# Altium schematic sheet Microcontroller and UI.SchDoc
size A4; SheetNumber: 2
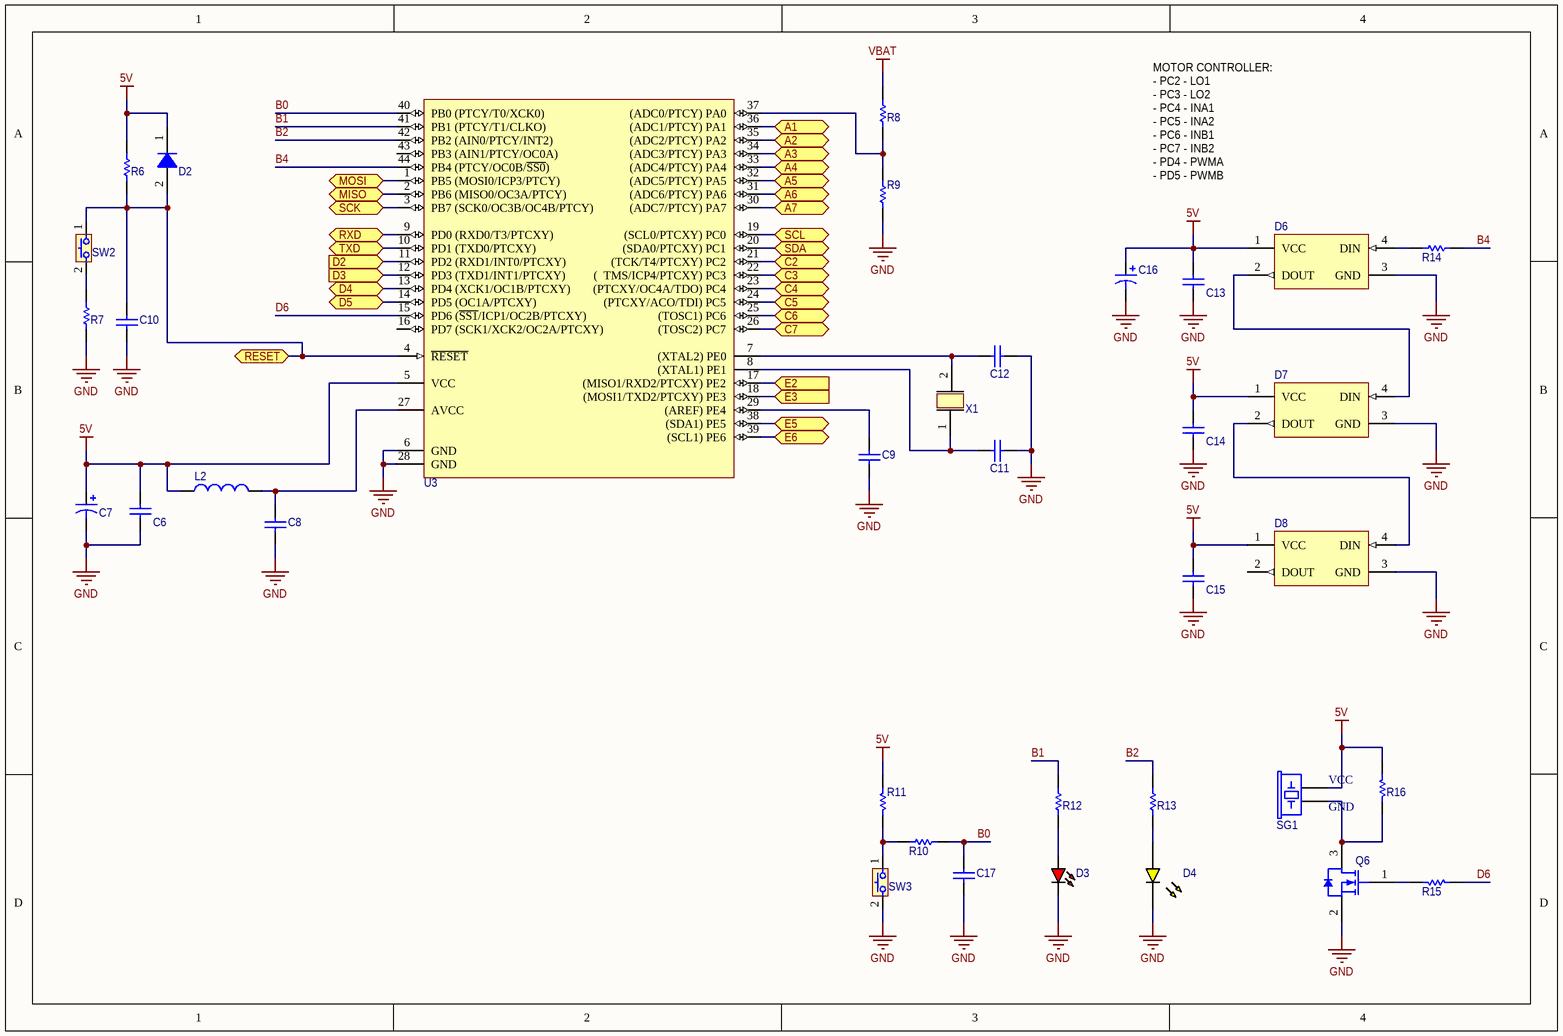
[diagram p0: Microcontroller and UI.SchDoc]

## Parts
C6  Kemet C1206C104K5RACAUTO  [CAPC3216X88X50ML20T25]  (value not drawn)
C7  Cap Pol2  [PCB-2utroa4rb2vd9is4ckmk-1]  (value not drawn)
C8  Kemet C1206C104K5RACAUTO  [CAPC3216X88X50ML20T25]  (value not drawn)
C9  Kemet C1206C104K5RACAUTO  [CAPC3216X88X50ML20T25]  (value not drawn)
C10  Kemet C1206C104K5RACAUTO  [CAPC3216X88X50ML20T25]  (value not drawn)
C11  Kemet C1206C220K5GACTU  [CAPC3216X88X50LL20T25]  (value not drawn)
C12  Kemet C1206C220K5GACTU  [CAPC3216X88X50LL20T25]  (value not drawn)
C13  Kemet C1206C104K5RACAUTO  [CAPC3216X88X50ML20T25]  (value not drawn)
C14  Kemet C1206C104K5RACAUTO  [CAPC3216X88X50ML20T25]  (value not drawn)
C15  Kemet C1206C104K5RACAUTO  [CAPC3216X88X50ML20T25]  (value not drawn)
C16  Panasonic EEEFK1C101P  [PCB-bxqn8ynar2jwyklg28q2-1]  (value not drawn)
C17  Kemet C1206C104K5RACAUTO  [CAPC3216X88X50ML20T25]  (value not drawn)
D2  Fairchild Semiconductor FDLL4148  [LL-34_AP455]  (value not drawn)
D3  Lite-On LTST-C170KRKT  [PCB-7utjwvdtdw1v8scx5ylt-1]  (value not drawn)
D4  Lite-On LTST-C170KSKT  [PCB-3srso9uc5heegaq4ztu4-1]  (value not drawn)
D6  TE-1981584-1  [PCB-20395447-2]  (value not drawn)
D7  TE-1981584-1  [PCB-20395447-2]  (value not drawn)
D8  TE-1981584-1  [PCB-20395447-2]  (value not drawn)
L2  Bourns CM453232-100KL  [PCB-sj0d1m6kkfqzu57ryeks-1]  (value not drawn)
Q6  SYM-ec4d21f6be82338a-2  [PCB-fnvh88uh0gwuonmuoobt-1]  (value not drawn)
R6  Vishay CRCW12064K70FKEA  [1206]  (value not drawn)
R7  Vishay CRCW1206330RFKEA  [PCB-iffx3kyo1buszuhrbsyd-1]  (value not drawn)
R8  Vishay CRCW12064K70FKEA  [1206]  (value not drawn)
R9  Vishay Dale CRCW12067K50FKTA  [RESC3216X60X45ML10T20]  (value not drawn)
R10  Vishay Dale CRCW12061K00FKEB  [RESC3216X60X45ML10T20]  (value not drawn)
R11  Res1  [PCB-r93x9swl7vzrlon1kcic-1]  (value not drawn)
R12  Vishay Dale CRCW12061K00FKEB  [RESC3216X60X45ML10T20]  (value not drawn)
R13  Vishay Dale CRCW12061K00FKEB  [RESC3216X60X45ML10T20]  (value not drawn)
R14  Vishay CRCW1206330RFKEA  [PCB-iffx3kyo1buszuhrbsyd-1]  (value not drawn)
R15  Res1  [PCB-r93x9swl7vzrlon1kcic-1]  (value not drawn)
R16  Res1  [PCB-r93x9swl7vzrlon1kcic-1]  (value not drawn)
SG1  SYM-4a3d82e3cb5995fa-1  [PCB-8mby96szrz0u2nyklaj3-1]  (value not drawn)
SW2  KMR231NGLFS  [PCB-073utuz7vwed4h5iqcvq-1]  (value not drawn)
SW3  KMR231NGLFS  [PCB-073utuz7vwed4h5iqcvq-1]  (value not drawn)
U3  SYM-89d944712a27561e-1  [PCB-mnk8bms7mnnc6ivbcvvg-1]  (value not drawn)
X1  Multicomp HC49S-16-30-50-70-30-ATF  [PCB-g1xa0dtupmw0r2hsib2r-1]  (value not drawn)

## Ports
A1, A2, A3, A4, A5, A6, A7, C2, C3, C4, C5, C6, C7, D2 (in), D3 (in), D4, D5, E2 (in), E3 (in), E5, E6, MISO, MOSI, RESET, RXD, SCK, SCL, SDA, TXD

## Nets
5V: C6.2 C7.1 C13.1 C14.1 C15.1 C16.1 D2.1(CATHODE) D6.1(VCC) D7.1(VCC) D8.1(VCC) L2.1 R6.1 R11.1 R16.2 SG1.0(+) U3.5(VCC)
GND: C6.1 C7.2 C8.1 C9.1 C10.1 C11.1 C12.1 C13.2 C14.2 C15.2 C16.2 C17.1 D3.2(K) D4.2(K) D6.3(GND) D7.3(GND) D8.3(GND) Q6.2(S) R7.2 R9.2 SW3.2 U3.6(GND) U3.28(GND)
VBAT: R8.2
A1: U3.36((ADC1/PTCY)_PA1) ; port A1
A2: U3.35((ADC2/PTCY)_PA2) ; port A2
A3: U3.34((ADC3/PTCY)_PA3) ; port A3
A4: U3.33((ADC4/PTCY)_PA4) ; port A4
A5: U3.32((ADC5/PTCY)_PA5) ; port A5
A6: U3.31((ADC6/PTCY)_PA6) ; port A6
A7: U3.30((ADC7/PTCY)_PA7) ; port A7
B0: C17.2 R10.2 U3.40(PB0_(PTCY/T0/XCK0))
B1: R12.2 U3.41(PB1_(PTCY/T1/CLKO))
B2: R13.2 U3.42(PB2_(AIN0/PTCY/INT2))
B4: R14.1 U3.44(PB4_(PTCY/OC0B/~{SS0}))
C2: U3.21((TCK/T4/PTCXY)_PC2) ; port C2
C3: U3.22((__TMS/ICP4/PTCXY)_PC3) ; port C3
C4: U3.23((PTCXY/OC4A/TDO)_PC4) ; port C4
C5: U3.24((PTCXY/ACO/TDI)_PC5) ; port C5
C6: U3.25((TOSC1)_PC6) ; port C6
C7: U3.26((TOSC2)_PC7) ; port C7
D2: U3.11(PD2_(RXD1/INT0/PTCXY)) ; port D2
D3: U3.12(PD3_(TXD1/INT1/PTCXY)) ; port D3
D4: U3.13(PD4_(XCK1/OC1B/PTCXY)) ; port D4
D5: U3.14(PD5_(OC1A/PTCXY)) ; port D5
D6: R15.2 U3.15(PD6_(~{SS1}/ICP1/OC2B/PTCXY))
E2: U3.17((MISO1/RXD2/PTCXY)_PE2) ; port E2
E3: U3.18((MOSI1/TXD2/PTCXY)_PE3) ; port E3
E5: U3.38((SDA1)_PE5) ; port E5
E6: U3.39((SCL1)_PE6) ; port E6
MISO: U3.2(PB6_(MISO0/OC3A/PTCY)) ; port MISO
MOSI: U3.1(PB5_(MOSI0/ICP3/PTCY)) ; port MOSI
RESET: C10.2 D2.2(ANODE) R6.2 SW2.1 U3.4(~{RESET}) ; port RESET
RXD: U3.9(PD0_(RXD0/T3/PTCXY)) ; port RXD
SCK: U3.3(PB7_(SCK0/OC3B/OC4B/PTCY)) ; port SCK
SCL: U3.19((SCL0/PTCXY)_PC0) ; port SCL
SDA: U3.20((SDA0/PTCXY)_PC1) ; port SDA
TXD: U3.10(PD1_(TXD0/PTCXY)) ; port TXD
NetC8_2: C8.2 L2.2 U3.27(AVCC)
NetC9_2: C9.2 U3.29((AREF)_PE4)
NetC11_2: C11.2 U3.8((XTAL1)_PE1) X1.1
NetC12_2: C12.2 U3.7((XTAL2)_PE0) X1.2
NetD3_1: D3.1(A) R12.1
NetD4_1: D4.1(A) R13.1
NetD6_2: D6.2(DOUT) D7.4(DIN)
NetD6_4: D6.4(DIN) R14.2
NetD7_2: D7.2(DOUT) D8.4(DIN)
NetQ6_1: Q6.1(G) R15.1
NetQ6_3: Q6.3(D) R16.1 SG1.1(-)
NetR7_1: R7.1 SW2.2
NetR8_1: R8.1 R9.1 U3.37((ADC0/PTCY)_PA0)
NetR10_1: R10.1 R11.2 SW3.1

Not connected (* = marked no-connect by the designer): D8 2(DOUT); U3 16(PD7_(SCK1/XCK2/OC2A/PTCXY)) 43(PB3_(AIN1/PTCY/OC0A))

## Notes on the sheet
- MOTOR CONTROLLER:
  - PC2 - LO1
  - PC3 - LO2
  - PC4 - INA1
  - PC5 - INA2
  - PC6 - INB1
  - PC7 - INB2
  - PD4 - PWMA
  - PD5 - PWMB
- (in symbol BPT14X) VCC; GND

## Library data of the parts
C6 = C1206C104K5RACAUTO: Cap Ceramic 0.1uF 50V X7R 10% SMD 1206 125C Plastic T/R; Capacitance: 1e-07 F; Lead-Free Status: R; Voltage Rating (DC): 50.0 V; Manufacturer Part Number: C1206C104K5RACAUTO; Capacitance Tolerance: ±10%; Case/Package: 1206; Dielectric Characteristic: X7R; Dielectric Material: Ceramic; Mounting Style: Surface Mount; Octopart Url: https://octopart.com/c1206c104k5racauto-kemet-12595586; OctopartID: 2beee2243f0af429; Packaging: Cut Tape (CT); REACH SVHC Compliance: No SVHC; RoHS: Compliant
C7 = T491C106K016AT4153: Cap Tant 10UF 10% 16V 2312
C8-C10 C13-C15 C17 = CMP-3062694-2: Cap Ceramic 0.1uF 50V X7R 10% SMD 1206 125C Plastic T/R; Capacitance: 1e-07 F; Lead-Free Status: R; Voltage Rating (DC): 50.0 V; Manufacturer Part Number: C1206C104K5RACAUTO; Capacitance Tolerance: ±10%; Case/Package: 1206; Dielectric Characteristic: X7R; Dielectric Material: Ceramic; Mounting Style: Surface Mount; Octopart Url: https://octopart.com/c1206c104k5racauto-kemet-12595586; OctopartID: 2beee2243f0af429; Packaging: Cut Tape (CT); REACH SVHC Compliance: No SVHC; RoHS: Compliant
C11 C12 = C1206C220K5GACTU: Capacitance: 2.2e-11 F; Capacitance Tolerance: ±10%; Dielectric Characteristic: C0G/NP0; Dielectric Material: Ceramic; Lead-Free Status: Lead Free; Voltage Rating (DC): 50.0 V; Manufacturer Part Number: C1206C220K5GACTU; Case/Package: 1206; Mounting Style: Surface Mount; Octopart Url: https://octopart.com/c1206c220k5gactu-kemet-4496258; OctopartID: ab38627615dc74ff; Packaging: Cut Tape (CT); RoHS: Compliant
C16 = EEEFK1C101P: Cap Aluminum Lytic 100uF 16V 20% (6.3 X 5.8mm) SMD 240mA 2000h 105°C Automotive T/R; Voltage Rating (DC): 16.0 V; Lead-Free Status: Lead Free; Dielectric Material: Aluminum Electrolytic; Capacitance: 0.0001 F; Size-Height: 0.0058 m; REACH SVHC Compliance: No SVHC; OctopartID: 6d97a4db90fcb250; Size-Diameter: 0.0063 m; Capacitance Tolerance: ±20%; Size-Width: 0.0078 m; Mounting Style: Surface Mount; Size-Length: 0.0058 m; Number of Pins: 2; Manufacturer Part Number: EEEFK1C101P; Packaging: Cut Tape (CT), Reel; Lifecycle Status: Not Listed by Manufacturer; RoHS: Compliant; Octopart URL: http://octopart.com/eeefk1c101p-panasonic-4642829
D2 = FDLL4148: Fairchild; Voltage Rating (DC): 100.0 V; Current Rating: 0.2 A; Polarity: Standard; Capacitance: 4e-12 F; Forward Voltage: 1.0 V; Lead-Free Status: Lead Free; Mounting Style: Surface Mount; REACH SVHC Compliance: No SVHC; Lifecycle Status: Active; OctopartID: b1e678e9918d6e21; RoHS: Compliant; Number of Pins: 2; Octopart Url: http://octopart.com/fdll4148-fairchild+semiconductor-328973; Manufacturer Part Number: FDLL4148; Seller Landing  Url: https://octopart-clicks.com/click/track?country=US&ak=8157f166&sig=011a551&sid=5489&ppid=328973&vpid=20232990&ct=offers
D3 = LTST-C170KRKT: Red 2 x 1.25 x 1.1 mm 130° Water Clear 54 mcd 2 V LED Surface Mount; Lens Type: Non-Diffused; Case/Package (SI): 2012; Luminous Intensity: 54.0 mcd; Lead-Free Status: Lead Free; Wavelength: 639 nm; Forward Voltage: 2.00 V; Mounting Style: Surface Mount, Vertical; Color: Red; Octopart URL: https://octopart.com/ltst-c170krkt-lite-on-549878; Manufacturer Part Number: LTST-C170KRKT; RoHS: Compliant; Size-Height: 1.10 mm; Size-Length: 2.00 mm; Case/Package: 0805; OctopartID: 1d24d4265bb4c2e3; Viewing Angle: 130 °; Size-Width: 1.25 mm; Operating Temperature: 85.0 °C (max)
D4 = LTST-C170KSKT: Yellow 2 x 1.25 x 1.1 mm 130° Water Clear 112 mcd 1.8 V LED Surface Mount; Forward Voltage: 2.00 V
D6-D8 = WS2812B: INTELLIGENT CONTROL LED without centered Pad; OctopartID: be34745cee7461f3
L2 = CM453232-100KL: Inductor General Purpose Chip Wirewound 10uH 10% 2.52MHz 50Q-Factor Ferrite 250mA 1.6Ohm DCR 1812 T/R; Case/Package (SI): 4532; Resonant Frequency: 20.0 MHz; Inductance: 10.0 µH; Resistance: 1.60 Ω; Q-Factor: 50.0; Mounting Style: Surface Mount; Manufacturer Part Number: CM453232-100KL; Current Rating: 250 mA; Packaging: Cut Tape (CT); Number of Pins: 2; REACH SVHC Compliance: No SVHC; Case/Package: 1812; Self Resonant Frequency: 20.0 MHz; RoHS: Compliant; OctopartID: f812311a91b727d5; Octopart URL: http://octopart.com/cm453232-100kl-bourns-150723
Q6 = BSS138P,215: Transistor Polarity: n Channel; Drain Source Voltage Vds: 60V; Continuous Drain Current Id: 360Ma; On Resistance...; Lead-Free Status: Lead Free; Mounting Style: Surface Mount; Lifecycle Status: Active; Operating Temperature: -55.0 °C to 150 °C; RoHS: Compliant; OctopartID: ec4d21f6be82338a; Manufacturer Part Number: BSS138P,215; Number of Pins: 3
R6 R8 = CRCW12064K70FKEA: RES SMD 4.7K OHM 1% 1/4W 1206; Case/Package (SI): 3216; Lead-Free Status: Lead Free; Power Rating: 0.25 W; Resistance: 4700.0 Ω; Voltage Rating (DC): 200.0 V; Case/Package: 1206; Mounting Style: Surface Mount; Number of Pins: 2; Octopart Url: https://octopart.com/crcw12064k70fkea-vishay-39455584; OctopartID: 3f78f428117ee0bf; REACH SVHC Compliance: No SVHC; Resistance Tolerance: ±1%; RoHS: Compliant; Size-Height: 0.00055 m; Size-Length: 0.0032 m; Size-Width: 0.0016 m; Manufacturer Part Number: CRCW12064K70FKEA
R7 R14 = CRCW1206330RFKEA: Res RES SMD 330 OHM 1% 1/4W 1206; RoHS: Compliant
R9 = CRCW12067K50FKTA: RES SMD 7.5K OHM 1% 1/4W 1206; Case/Package (SI): 3216; Lead-Free Status: Contains Lead; Power Dissipation: 0.25 W; Resistance: 7500.0 Ω; Temperature Coefficient: 100.0 ppm/°C; Voltage Rating (DC): 200.0 V; Manufacturer Part Number: CRCW12067K50FKTA; Case/Package: 1206; Mounting Style: Surface Mount; Octopart Url: https://octopart.com/crcw12067k50fkta-vishay-39410547; OctopartID: b2ac79ffccb96d6b; Power Rating: 0.25 W; Resistance Tolerance: ±1%; RoHS: Non-Compliant; Size-Height: 0.00055 m; Size-Length: 0.0032 m; Size-Width: 0.0016 m
R10 R12 R13 = CRCW12061K00FKEB: Thick Film Resistors - SMD 1/4watt 1Kohms 1%; Lead-Free Status: Lead Free; Power Rating: 0.25 W; Resistance: 1000.0 Ω; Voltage Rating (DC): 200.0 V; Case/Package: 1206; Number of Pins: 2; Octopart Url: https://octopart.com/crcw12061k00fkeb-vishay+dale-42466336; OctopartID: 6554aed9bc12ba93; Resistance Tolerance: ±1%; RoHS: Compliant; Manufacturer Part Number: CRCW12061K00FKEB
R11 R15 R16 = CRCW120610K0FKTA: Res Thick Film 1206 10K Ohm 1% 1/4W ±100ppm/°C Molded SMD SMD Paper T/R; Resistance: 10.0 kΩ; Temperature Coefficient: -100 ppm/°C to 100 ppm/°C; Octopart URL: https://octopart.com/crcw120610k0fkta-vishay-40299249; Number of Pins: 2; Manufacturer Part Number: CRCW120610K0FKTA
SG1 = BPT14X: Sound transducer: piezo alarm; with built-in generator; THT
SW2 SW3 = KMR231NGLFS: Switch Tactile N.O. SPST Button Gull Wing 0.05A 32VDC 1VA 150000Cycles 3N SMD Automotive T/R
U3 = CMP-89d944712a27561e-1: AVR microcontroller; EEPROM: 1kB; SRAM: 2kB; Flash: 32kB; TQFP44; Lead-Free Status: Lead Free; Case/Package: TQFP; RoHS: Compliant; Mounting Style: Surface Mount; Lifecycle Status: Not Listed by Manufacturer; OctopartID: 89d944712a27561e; Octopart URL: https://octopart.com/atmega324pb-au-microchip-77760152
X1 = CMP-c0ad0924a56a1f6a-3: CRYSTAL, HC-49/S, 16.0MHZ; Ouput Frequency: 16.0MHz; Accuracy: ± 30ppm; Operating Temperature Range: -20°C to +70°C; ...; Load Capacitance: 30.0 pF; Octopart URL: http://octopart.com/hc49s-16-30-50-70-30-atf-multicomp-8601761; OctopartID: c0ad0924a56a1f6a